# Altium schematic sheet [9] - STM32F407 Controller.SchDoc: STM32F407-- Main Controller
size A3; Project Code: A_V1.3; Date: 2025-08-10; ApprovedBy: M Pourmand; CheckedBy: M Pourmand; Author: M Pourmand; CompanyName: Freelance; DrawnBy: M Pourmand; Engineer: M Pourmand; Organization: Freelance; Address1: Paradisgränd 03; Address2: Umedalen; Address3: Umeå; Address4: Sweden; DocumentNumber: 0101020251118001; SheetNumber: 1; SheetTotal: 11; ItemRevision: 1; Time: 17:40
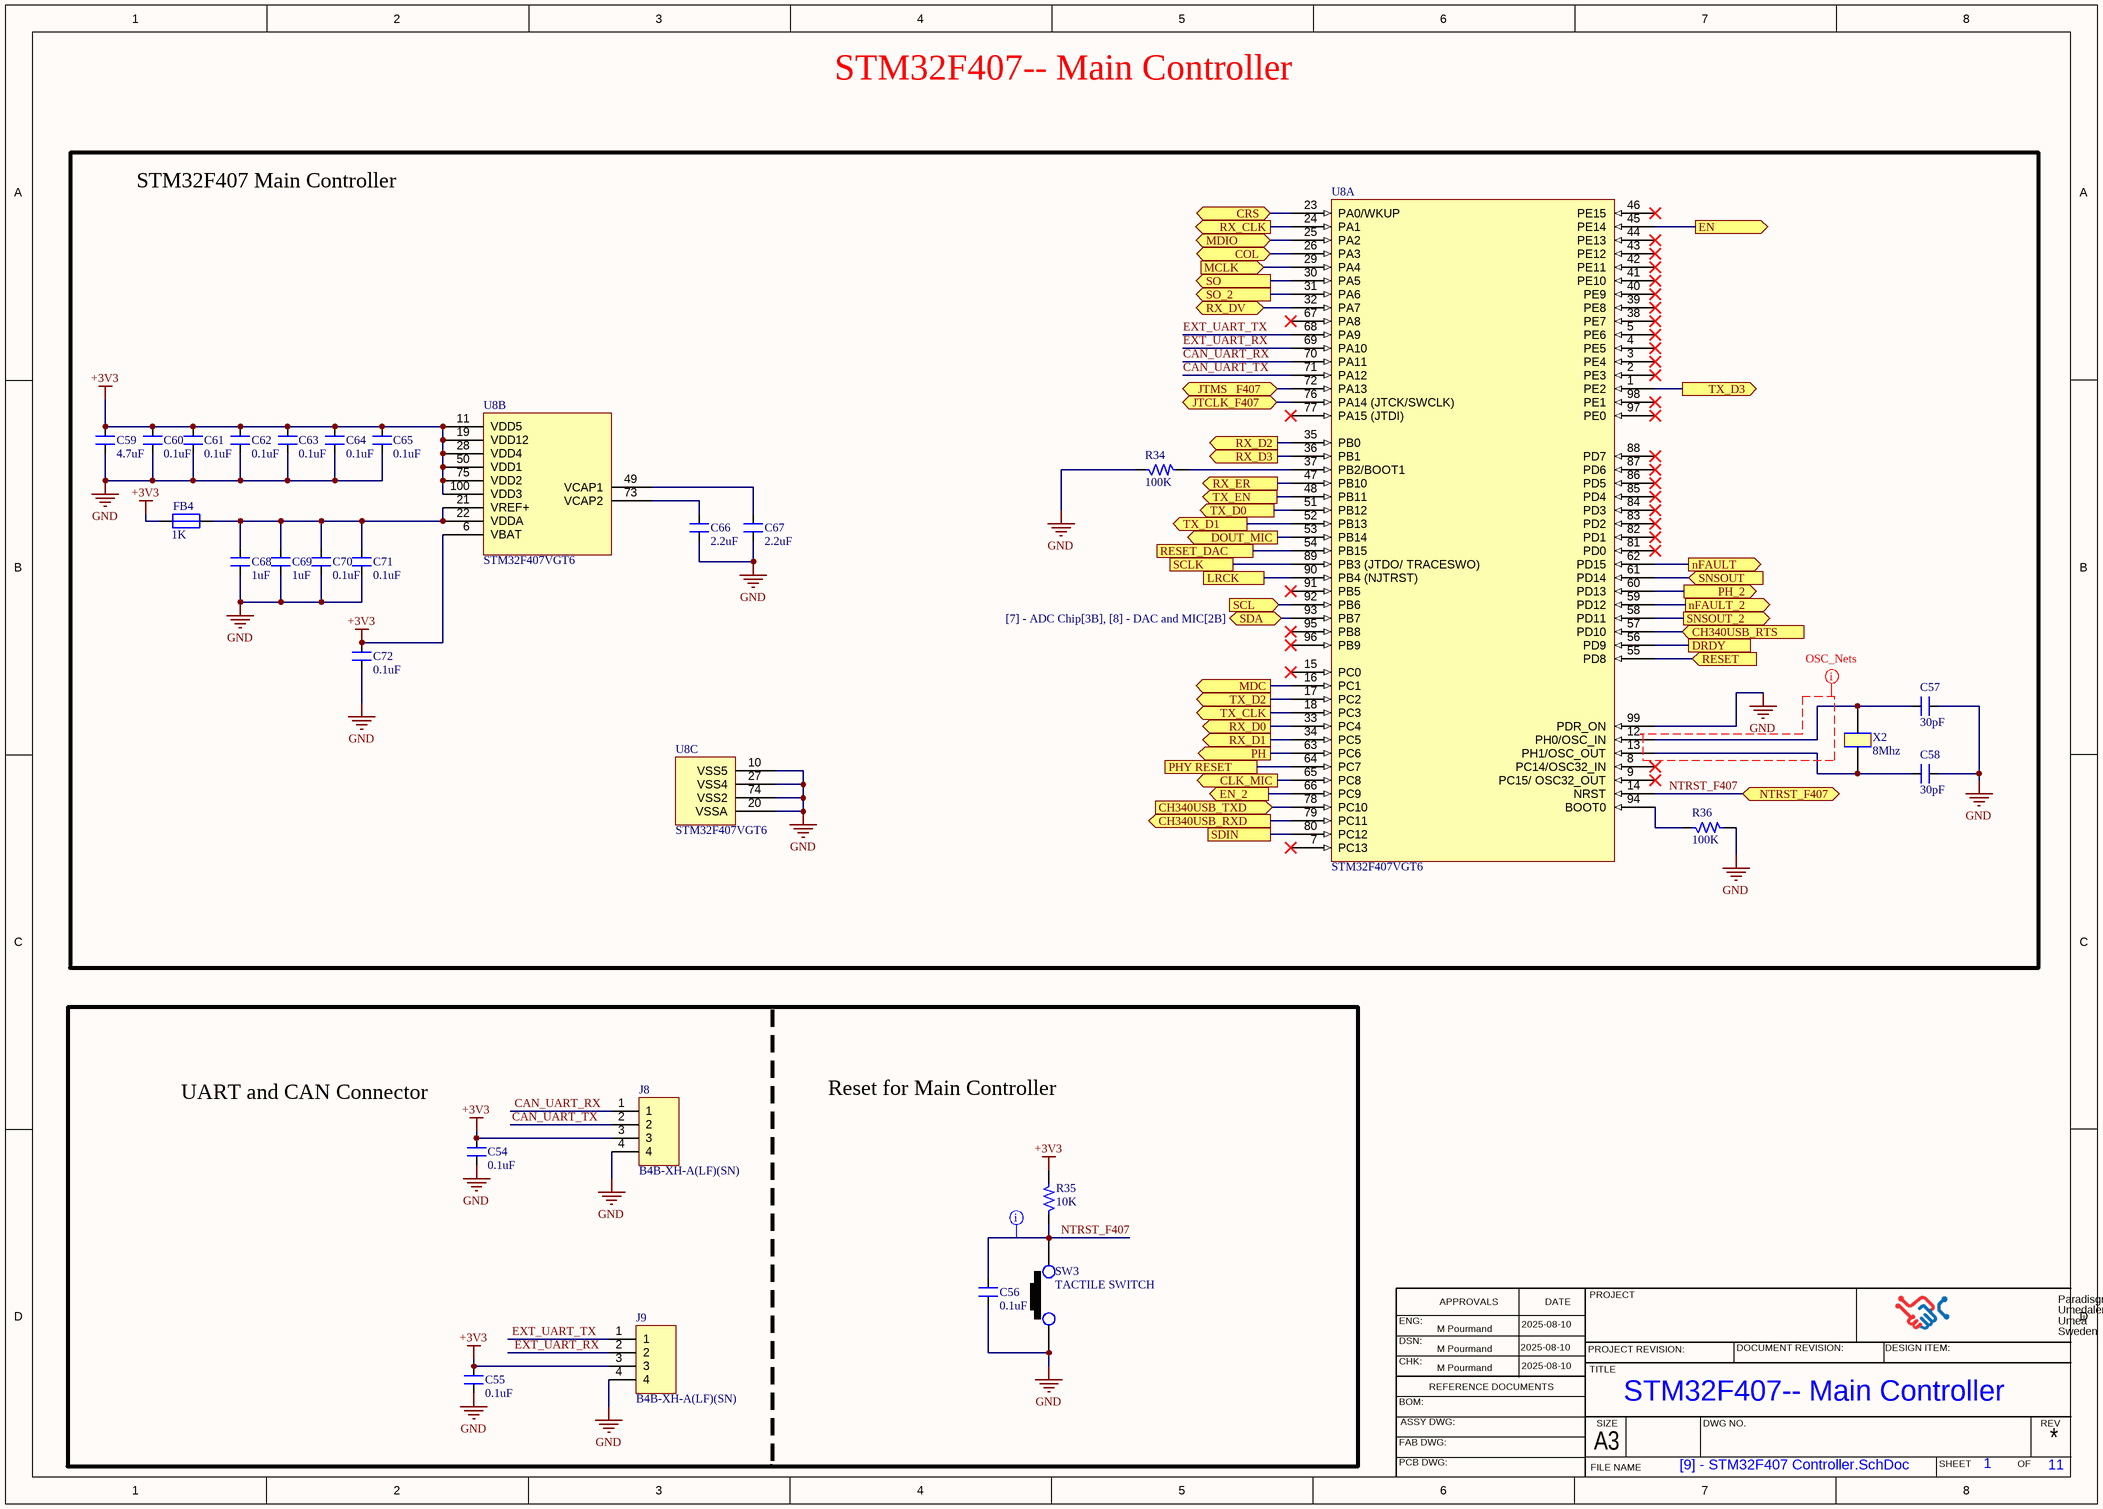
[diagram p0: [9] - STM32F407 Controller.SchDoc]

## Parts
C54  0.1uF  [CAP_0805]
C55  0.1uF  [CAP_0805]
C56  0.1uF  [CAP_0805]
C57  30pF  [CAP_0805]
C58  30pF  [CAP_0805]
C59  4.7uF  [CAP_0805]
C60  0.1uF  [CAP_0805]
C61  0.1uF  [CAP_0805]
C62  0.1uF  [CAP_0805]
C63  0.1uF  [CAP_0805]
C64  0.1uF  [CAP_0805]
C65  0.1uF  [CAP_0805]
C66  2.2uF  [CAP_0805]
C67  2.2uF  [CAP_0805]
C68  1uF  [CAP_0805]
C69  1uF  [CAP_0805]
C70  0.1uF  [CAP_0805]
C71  0.1uF  [CAP_0805]
C72  0.1uF  [CAP_0805]
FB4  1K  [IND_0805]
J8  B4B-XH-A(LF)(SN)  [CON4_100_B4B-XH-A_TH_ST]
J9  B4B-XH-A(LF)(SN)  [CON4_100_B4B-XH-A_TH_ST]
R34  100K  [RES_0603]
R35  10K  [RES_0603]
R36  100K  [RES_0603]
SW3  TACTILE SWITCH  [SW_342_SMD]
U8  STM32F407VGT6  [QFN100_19.6_669_58X10_SMD]  (parts A,B,C of 3)
X2  8Mhz  [XTAL_314_240X47_SMD]

## Blocks framed on the sheet
STM32F407 Main Controller: C57-C72 FB4 R34 R36 U8 X2

## Ports
CH340USB_RTS (in, see [6] - CH340C[3B]), CH340USB_RXD (out, see [6] - CH340C[3B]), CH340USB_TXD (in, see [6] - CH340C[3B]), CLK_MIC (out, see [8] - DAC and MIC[1D]), COL (bidir, see [4] - Ethernet PHY[2B]), CRS (bidir, see [4] - Ethernet PHY[2B]), DOUT_MIC (out, see [8] - DAC and MIC[1D]), DRDY (see [7] - ADC Chip[3B]), EN (out, see [5] - Motor Driver Schematic[2C]), EN_2 (out, see [10] - Motor Driver- 2[2C]), JTCLK_F407 (bidir, see [3] - STM32F103 Debugger[3C]), JTMS   F407 (bidir, see [3] - STM32F103 Debugger[3C]), LRCK (see [8] - DAC and MIC[2B]), MCLK (in, see [8] - DAC and MIC[2B]), MDC (out, see [4] - Ethernet PHY[2D]), MDIO (bidir, see [4] - Ethernet PHY[2D]), nFAULT (out, see [5] - Motor Driver Schematic[1B]), nFAULT_2 (out, see [10] - Motor Driver- 2[1B]), NTRST_F407 (bidir, see [3] - STM32F103 Debugger[2D]), PH (out, see [5] - Motor Driver Schematic[2C]), PH_2 (out, see [10] - Motor Driver- 2[2C]), PHY RESET (see [4] - Ethernet PHY[1A]), RESET (in, see [7] - ADC Chip[2B]), RESET_DAC (see [8] - DAC and MIC[2B]), RX_CLK (out, see [4] - Ethernet PHY[3C]), RX_D0 (out, see [4] - Ethernet PHY[2D]), RX_D1 (out, see [4] - Ethernet PHY[2D]), RX_D2 (out, see [4] - Ethernet PHY[2D]), RX_D3 (out, see [4] - Ethernet PHY[2D]), RX_DV (bidir, see [4] - Ethernet PHY[3C]), RX_ER (out, see [4] - Ethernet PHY[3C]), SCL (in, see [7] - ADC Chip[3B], [8] - DAC and MIC[2B]), SCLK (see [8] - DAC and MIC[2B]), SDA (bidir, see [7] - ADC Chip[3B], [8] - DAC and MIC[2B]), SDIN (see [8] - DAC and MIC[2B]), SNSOUT (in, see [5] - Motor Driver Schematic[1B]), SNSOUT_2 (out, see [10] - Motor Driver- 2[1B]), SO (out, see [5] - Motor Driver Schematic[1B]), SO_2 (out, see [10] - Motor Driver- 2[1B]), TX_CLK (out, see [4] - Ethernet PHY[3B]), TX_D0 (out, see [4] - Ethernet PHY[3B]), TX_D1 (out, see [4] - Ethernet PHY[2B]), TX_D2 (out, see [4] - Ethernet PHY[2B]), TX_D3 (out, see [4] - Ethernet PHY[2B]), TX_EN (out, see [4] - Ethernet PHY[3B])

## Nets
+3V3: C54.2 C55.2 C59.2 C60.2 C61.2 C62.2 C63.2 C64.2 C65.2 C72.2 FB4.1 J8.3 J9.3 R35.2 U8.6(VBAT) U8.11(VDD5) U8.19(VDD12) U8.28(VDD4) U8.50(VDD1) U8.75(VDD2) U8.100(VDD3)
GND: C54.1 C55.1 C56.1 C57.2 C58.2 C59.1 C60.1 C61.1 C62.1 C63.1 C64.1 C65.1 C66.1 C67.1 C68.1 C69.1 C70.1 C71.1 C72.1 J8.4 J9.4 R34.1 R36.2 SW3.1 U8.10(VSS5) U8.20(VSSA) U8.27(VSS4) U8.74(VSS2) U8.99(PDR_ON)
CAN_UART_RX: J8.1 U8.70(PA11)
CAN_UART_TX: J8.2 U8.71(PA12)
CH340USB_RTS: U8.57(PD10) ; port CH340USB_RTS
CH340USB_RXD: U8.79(PC11) ; port CH340USB_RXD
CH340USB_TXD: U8.78(PC10) ; port CH340USB_TXD
CLK_MIC: U8.65(PC8) ; port CLK_MIC
COL: U8.26(PA3) ; port COL
CRS: U8.23(PA0/WKUP) ; port CRS
DOUT_MIC: U8.53(PB14) ; port DOUT_MIC
DRDY: U8.56(PD9) ; port DRDY
EN: U8.45(PE14) ; port EN
EN_2: U8.66(PC9) ; port EN_2
EXT_UART_RX: J9.2 U8.69(PA10)
EXT_UART_TX: J9.1 U8.68(PA9)
JTCLK_F407: U8.76(PA14_(JTCK/SWCLK)) ; port JTCLK_F407
JTMS   F407: U8.72(PA13) ; port JTMS   F407
LRCK: U8.90(PB4_(NJTRST)) ; port LRCK
MCLK: U8.29(PA4) ; port MCLK
MDC: U8.16(PC1) ; port MDC
MDIO: U8.25(PA2) ; port MDIO
nFAULT: U8.62(PD15) ; port nFAULT
nFAULT_2: U8.59(PD12) ; port nFAULT_2
NTRST_F407: C56.2 R35.1 SW3.2 U8.14(NRST) ; port NTRST_F407
PH: U8.63(PC6) ; port PH
PH_2: U8.60(PD13) ; port PH_2
PHY RESET: U8.64(PC7) ; port PHY RESET
RESET: U8.55(PD8) ; port RESET
RESET_DAC: U8.54(PB15) ; port RESET_DAC
RX_CLK: U8.24(PA1) ; port RX_CLK
RX_D0: U8.33(PC4) ; port RX_D0
RX_D1: U8.34(PC5) ; port RX_D1
RX_D2: U8.35(PB0) ; port RX_D2
RX_D3: U8.36(PB1) ; port RX_D3
RX_DV: U8.32(PA7) ; port RX_DV
RX_ER: U8.47(PB10) ; port RX_ER
SCL: U8.92(PB6) ; port SCL
SCLK: U8.89(PB3_(JTDO/_TRACESWO)) ; port SCLK
SDA: U8.93(PB7) ; port SDA
SDIN: U8.80(PC12) ; port SDIN
SNSOUT: U8.61(PD14) ; port SNSOUT
SNSOUT_2: U8.58(PD11) ; port SNSOUT_2
SO: U8.30(PA5) ; port SO
SO_2: U8.31(PA6) ; port SO_2
TX_CLK: U8.18(PC3) ; port TX_CLK
TX_D0: U8.51(PB12) ; port TX_D0
TX_D1: U8.52(PB13) ; port TX_D1
TX_D2: U8.17(PC2) ; port TX_D2
TX_D3: U8.1(PE2) ; port TX_D3
TX_EN: U8.48(PB11) ; port TX_EN
NetC57_1: C57.1 U8.12(PH0/OSC_IN) X2.2
NetC58_1: C58.1 U8.13(PH1/OSC_OUT) X2.1
NetC66_2: C66.2 U8.73(VCAP2)
NetC67_2: C67.2 U8.49(VCAP1)
NetC68_2: C68.2 C69.2 C70.2 C71.2 FB4.2 U8.21(VREF+) U8.22(VDDA)
NetR34_2: R34.2 U8.37(PB2/BOOT1)
NetR36_1: R36.1 U8.94(BOOT0)

Not connected (* = marked no-connect by the designer): U8 2(PE3)* 3(PE4)* 4(PE5)* 5(PE6)* 7(PC13)* 8(PC14/OSC32_IN)* 9(PC15/_OSC32_OUT)* 15(PC0)* 38(PE7)* 39(PE8)* 40(PE9)* 41(PE10)* 42(PE11)* 43(PE12)* 44(PE13)* 46(PE15)* 67(PA8)* 77(PA15_(JTDI))* 81(PD0)* 82(PD1)* 83(PD2)* 84(PD3)* 85(PD4)* 86(PD5)* 87(PD6)* 88(PD7)* 91(PB5)* 95(PB8)* 96(PB9)* 97(PE0)* 98(PE1)*

## Layout directives
net class OSC_nets: (no net found under the mark)
net class Crit_Nets: NTRST_F407

## Notes on the sheet
- STM32F407-- Main Controller
- UART and CAN Connector
- Reset for Main Controller
- ENG:
- APPROVALS
- DATE
- PROJECT
- DSN:
- CHK:
- REFERENCE DOCUMENTS
- PROJECT REVISION:
- TITLE
- DOCUMENT REVISION:
- DESIGN ITEM:
- BOM:
- FAB DWG:
- PCB DWG:
- ASSY DWG:
- FILE NAME
- A3
- SIZE
- DWG NO.
- SHEET
- OF
- REV

## Library data of the parts
C54-C56 C60-C65 C70-C72 = CAP_0.1uF-50V-10%-0805: 0.1µF ±10% 50V Ceramic Capacitor X7R 0805 (2012 Metric); Manufacturer: Samsung; Manufacturer Part Number: CL21B104KBCNNNC; Alternate Part Number-1: NA; Case/Package: 0805; Supplier-1: SIRICOM; Supplier Part Number-1: 0805B104K500CT
C57 C58 = CAP_30pF-50V-10%-0805: ±10% 50V Ceramic Capacitor C0G, NP0 0805 (2012 Metric); Manufacturer Part Number: C0805C300K5GAC7800; Manufacturer: KEMET; Alternate Part Number: NA; Case/Package: 0805; Supplier-1: Digikey; Supplier Part Number-1: 399-17443-1-ND - Cut Tape (CT)
C59 = CAP_4.7uF-50V-10%-0805: 4.7µF ±10% 50V Ceramic Capacitor X5R 0805 (2012 Metric); Manufacturer: Yageo; Manufacturer Part Number: GRM21BR61H475KE51L; Alternate Part Number-1: NA; Case/Package: 0805; Supplier-1: SIRICOM; Supplier Part Number-1: CL21A475KBQNNNE
C66 C67 = CAP_2.2uF-25V-10%-0805: 2.2µF ±10% 25V Ceramic Capacitor X7R 0805 (2012 Metric); Manufacturer: KEMET; Manufacturer Part Number: CL21B225KAFNFNE; Alternate Part Number-1: NA; Case/Package: 0805; Supplier-1: SIRICOM; Supplier Part Number-1: CL21A225KAFNNNE
C68 C69 = CAP_1uF-50V-5%-0805: 1µF ±5% 50V Ceramic Capacitor X7R 0805 (2012 Metric); Manufacturer: Samsung; Manufacturer Part Number: CC0805JKX7R9BB105; Alternate Part Number-1: 0805F105M500NT; Case/Package: 0805; Supplier-1: SIRICOM; Supplier Part Number-1: CL21B105KBFNNNE
FB4 = FB_1K-100MHZ-1.6A-0805: 1 kOhms @ 100MHz 1 Power Line Ferrite Bead 0805 (2012 Metric) 1.6A; Manufacturer: Laird; Manufacturer Part Number: BLM21SP102SH1D; Alternate Part Number-1: NA; Case/Package: 0805; Supplier-1: SIRICOM; Supplier Part Number-1: ACMS201209A102
J8 J9 = CON-PLG_4X1-100-ST-TH: 4 Pins, 1 Row 2.54mm Pitch, straight Connector, male; Manufacturer: Wurth Electronics; Mating Part Number: XHP-4; Crimp Part Number: ASXHSXH22K51; Alternate Part Number-1: NA; Manufacturer Part Number: B4B-XH-A(LF)(SN); Case/Package: TH-CON; Supplier-1: LCSC; Supplier Part Number-1: B4B-XH-A(LF)(SN)
R34 R36 = RES_100K-0.1W-1%-0603: 100 kOhms ±1% 0.1W, 1/10W Chip Resistor 0603 (1608 Metric) Automotive AEC-Q200 Thick Film; Manufacturer: Stackpole Electronics; Manufacturer Part Number: RMCF0603FT100K; Alternate Part Number-1: NA; Case/Package: 0603; Supplier-1: Arrow; Supplier Part Number-1: RMCF0603FT100K
R35 = RES_10K-0.1W-1%-0603: 10 kOhms ±1% 0.1W, 1/10W Chip Resistor 0603 (1608 Metric) Automotive AEC-Q200 Thick Film; Manufacturer: Walsin; Manufacturer Part Number: WR06X1002FTL; Alternate Part Number-1: 0603WAJ0103T5E; Case/Package: 0603; Supplier-1: SIRICOM; Supplier Part Number-1: WR06X1002FTL
SW3 = SW1_RS-282G05A3-SMRT-SMD: Tactile Switch SPST-NO Top Actuated Surface Mount; Manufacturer: ITT C&K; Alternate Part Number-1: NA; Manufacturer Part Number: RS-282G05A3-SMRT; Case/Package: SMD; Supplier-1: SP ROAD; Supplier Part Number-1: RS-282G05A3-SMRT
U8 = IC_STM32F407VGT6: ARM® Cortex®-M4 STM32F4 Microcontroller IC 32-Bit 168MHz 1MB (1M x 8) FLASH 100-LQFP (14x14); Manufacturer: STMicroelectronics; Alternate Part Number-1: STM32F407VET6; Manufacturer Part Number: STM32F407VGT6; Case/Package: LQFP100; Supplier-1: ARROW; Supplier Part Number-1: STM32F407VGT6
X2 = XTAL_8MHZ-ECS-80-32-5PX-SMD: 8MHz ±30ppm Crystal 32pF 60 Ohms HC-49/US; Manufacturer: Fox Electronics; Manufacturer Part Number: ECS-80-32-5PX-TR; Alternate Part Number-1: NA; Case/Package: SMD/SMT; Supplier-1: SP ROAD; Supplier Part Number-1: ECS-80-32-5PX-TR